# EAGLE schematic CFT-PB2-smd-revD (EAGLE 5.11)
DRAWN_BY: Alexios; PROJECT_NAME: CFT Mini-Computer; REVISION: Rev B; SHEET_DESCRIPTION: Cover Sheet; SIMULATION_FILENAME: register.v#reg_L; URL: http://www.bedroomlan.org/cft

## Sheet 1 of 6
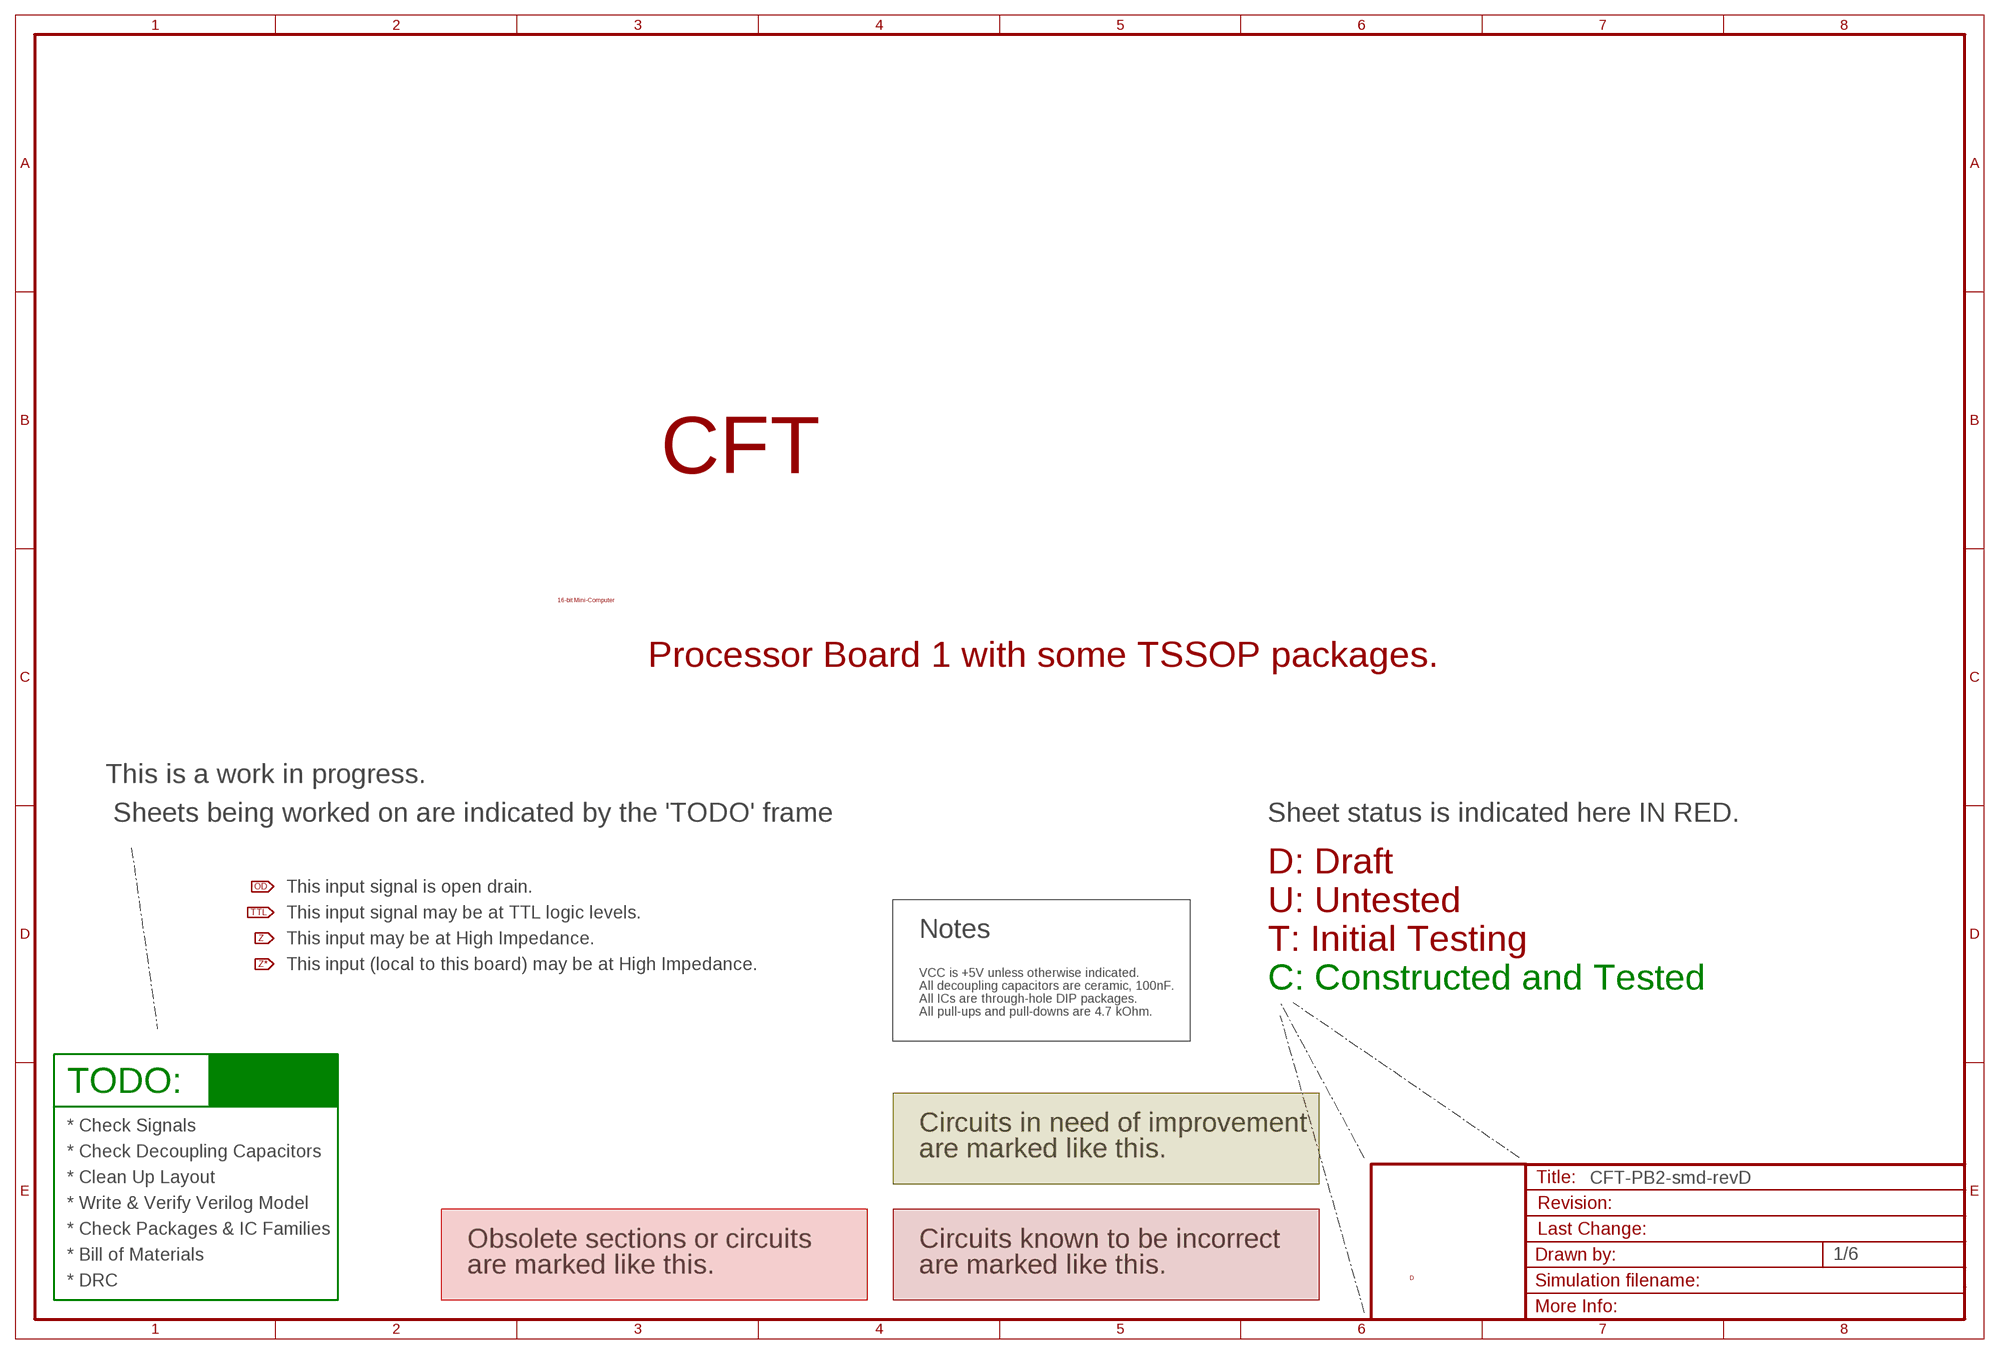
[diagram p0: schematic, sheet 1]

### Notes on the sheet
- CFT
- 16-bit Mini-Computer
- Processor Board 1 with some TSSOP packages.
- This is a work in progress.
- Sheets being worked on are indicated by the 'TODO' frame | Sheet status is indicated here IN RED.
- D: Draft
- This input signal is open drain.
- U: Untested
- This input signal may be at TTL logic levels.
- Notes
- This input may be at High Impedance.
- T: Initial Testing
- This input (local to this board) may be at High Impedance.
- VCC is +5V unless otherwise indicated.
- All decoupling capacitors are ceramic, 100nF. | C: Constructed and Tested
- All ICs are through-hole DIP packages.
- All pull-ups and pull-downs are 4.7 kOhm.
- TODO:
- * Check Signals | Circuits in need of improvement
- * Check Decoupling Capacitors | are marked like this.
- * Clean Up Layout
- * Write & Verify Verilog Model
- * Check Packages & IC Families
- Obsolete sections or circuits | Circuits known to be incorrect
- * Bill of Materials
- are marked like this. | are marked like this.
- D
- * DRC

## Sheet 2 of 6
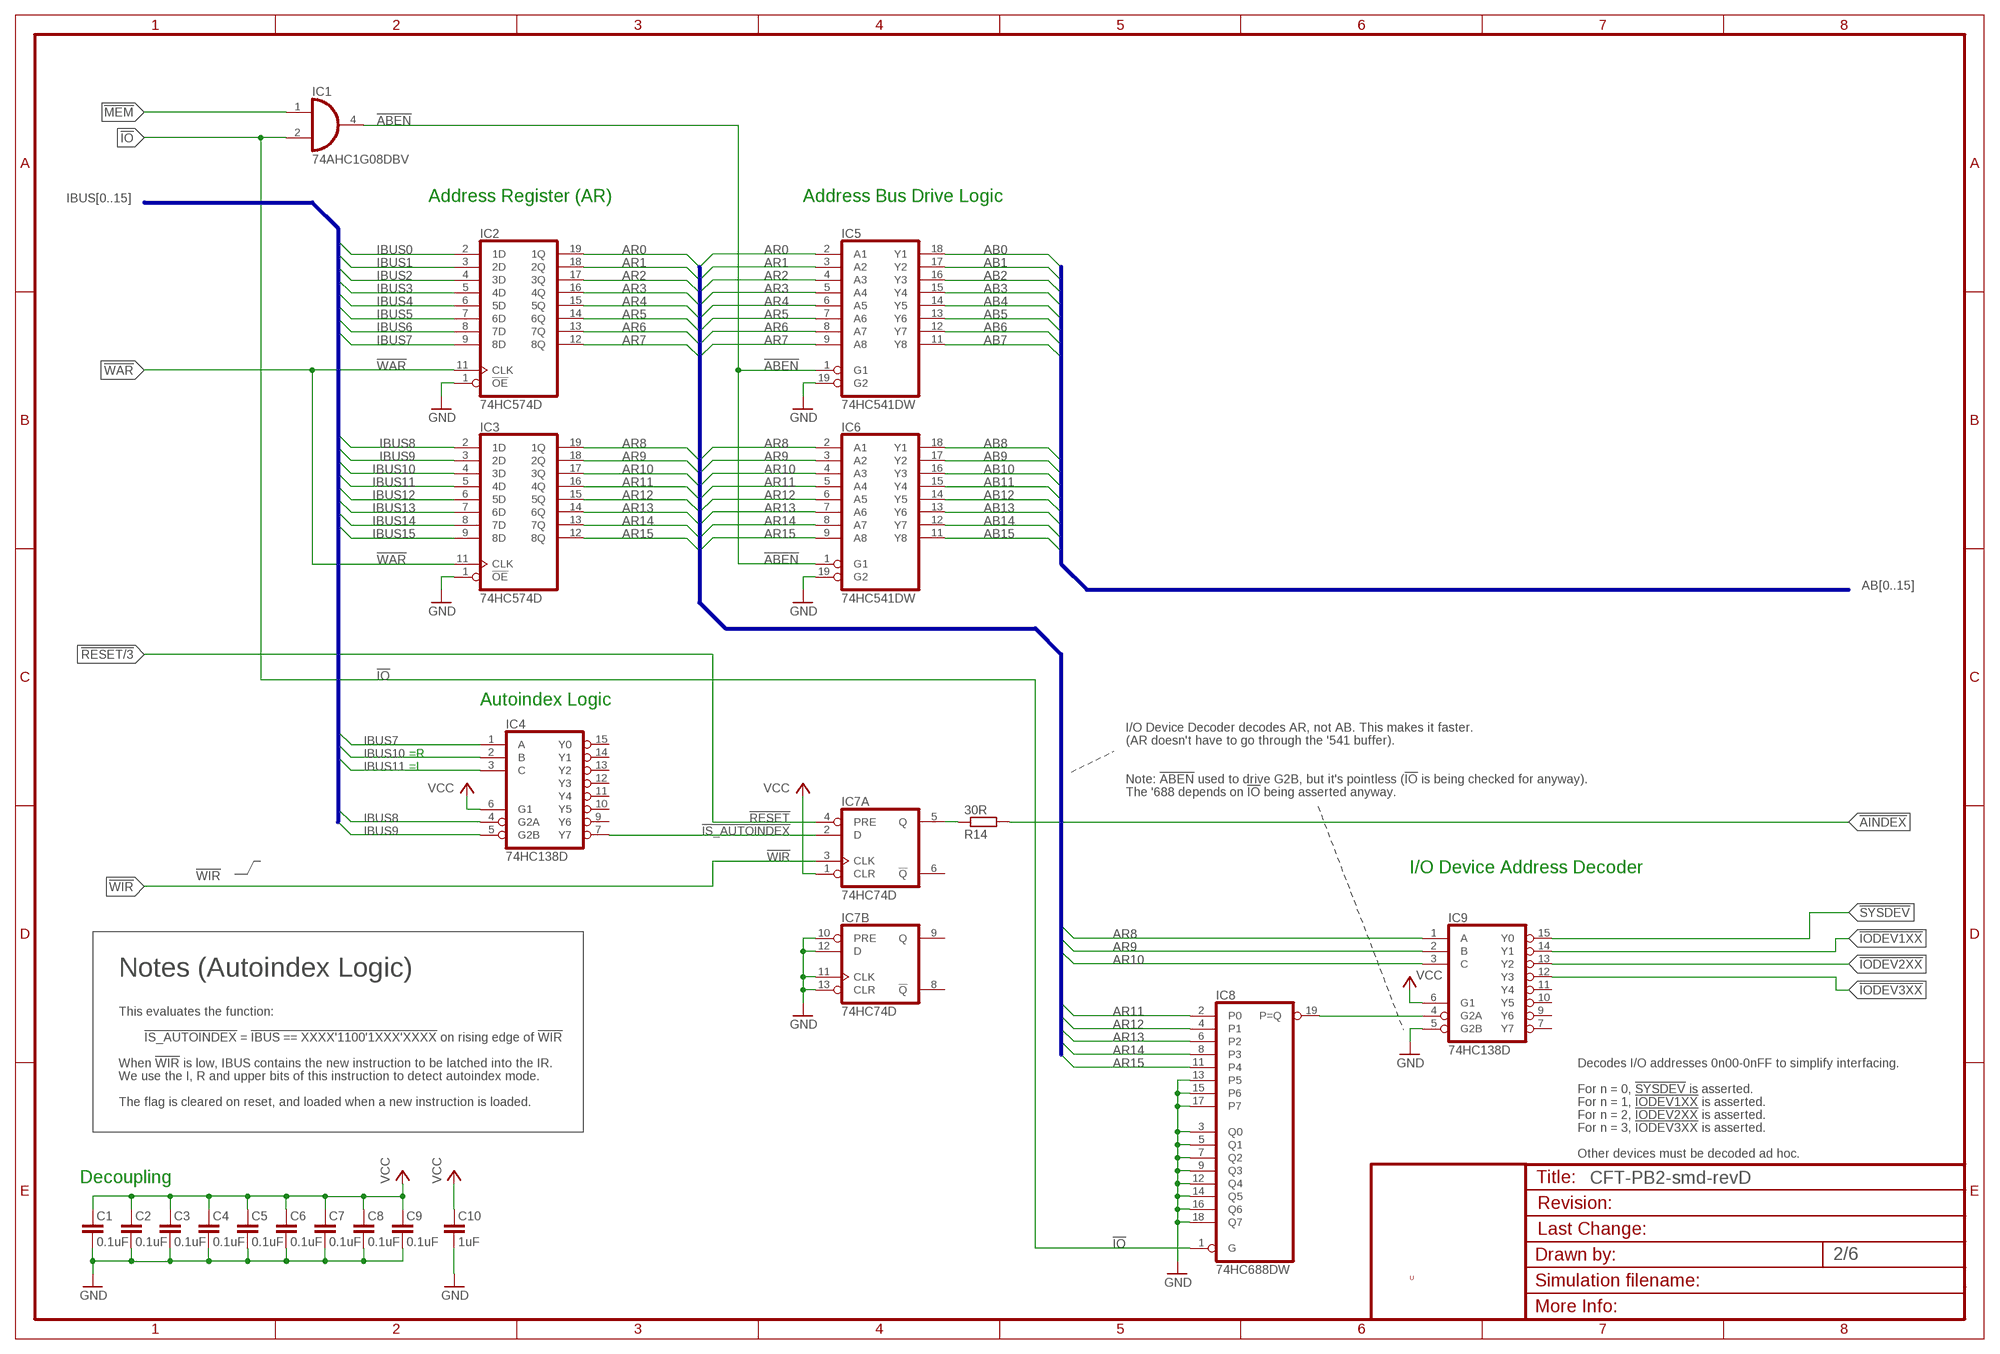
[diagram p1: schematic, sheet 2]

### Parts
C1  0.1uF  C-EUC0805K  [C0805K]
C2  0.1uF  C-EUC0805K  [C0805K]
C3  0.1uF  C-EUC0805K  [C0805K]
C4  0.1uF  C-EUC0805K  [C0805K]
C5  0.1uF  C-EUC0805K  [C0805K]
C6  0.1uF  C-EUC0805K  [C0805K]
C7  0.1uF  C-EUC0805K  [C0805K]
C8  0.1uF  C-EUC0805K  [C0805K]
C9  0.1uF  C-EUC0805K  [C0805K]
C10  1uF  C-EUC0805K  [C0805K]
IC1  74AHC1G08DBV  [SOT23-5]
IC2  74HC574D  [SO20W]
IC3  74HC574D  [SO20W]
IC4  74HC138D  [SO16]
IC5  74HC541DW  [SO20W]
IC6  74HC541DW  [SO20W]
IC7  74HC74D  [SO14]
IC8  74HC688DW  [SO20W]
IC9  74HC138D  [SO16]
R14  30R  R-EU_R0805  [R0805]

### Nets
!ABEN: IC1.4(O) IC5.1(G1) IC6.1(G1)
!AINDEX: R14.2 ; also sheet 6
!IO: IC1.2(I1) IC8.1(G) ; also sheet 6
!IODEV1XX: IC9.14(Y1) ; also sheet 6
!IODEV2XX: IC9.13(Y2) ; also sheet 6
!IODEV3XX: IC9.12(Y3) ; also sheet 6
!IS_AUTOINDEX: IC4.7(Y7) IC7.2(A:D)
!MEM: IC1.1(I0) ; also sheet 6
!RESET: IC7.4(A:PRE) ; also sheet 3,6
!SYSDEV: IC9.15(Y0) ; also sheet 6
!WAR: IC2.11(CLK) IC3.11(CLK) ; also sheet 6
!WIR: IC7.3(A:CLK) ; also sheet 6
AB0: IC5.18(Y1) ; also sheet 6
AB1: IC5.17(Y2) ; also sheet 6
AB2: IC5.16(Y3) ; also sheet 6
AB3: IC5.15(Y4) ; also sheet 6
AB4: IC5.14(Y5) ; also sheet 6
AB5: IC5.13(Y6) ; also sheet 6
AB6: IC5.12(Y7) ; also sheet 6
AB7: IC5.11(Y8) ; also sheet 6
AB8: IC6.18(Y1) ; also sheet 6
AB9: IC6.17(Y2) ; also sheet 6
AB10: IC6.16(Y3) ; also sheet 6
AB11: IC6.15(Y4) ; also sheet 6
AB12: IC6.14(Y5) ; also sheet 6
AB13: IC6.13(Y6) ; also sheet 6
AB14: IC6.12(Y7) ; also sheet 6
AB15: IC6.11(Y8) ; also sheet 6
AR0: IC2.19(1Q) IC5.2(A1)
AR1: IC2.18(2Q) IC5.3(A2)
AR2: IC2.17(3Q) IC5.4(A3)
AR3: IC2.16(4Q) IC5.5(A4)
AR4: IC2.15(5Q) IC5.6(A5)
AR5: IC2.14(6Q) IC5.7(A6)
AR6: IC2.13(7Q) IC5.8(A7)
AR7: IC2.12(8Q) IC5.9(A8)
AR8: IC3.19(1Q) IC6.2(A1) IC9.1(A)
AR9: IC3.18(2Q) IC6.3(A2) IC9.2(B)
AR10: IC3.17(3Q) IC6.4(A3) IC9.3(C)
AR11: IC3.16(4Q) IC6.5(A4) IC8.2(P0)
AR12: IC3.15(5Q) IC6.6(A5) IC8.4(P1)
AR13: IC3.14(6Q) IC6.7(A6) IC8.6(P2)
AR14: IC3.13(7Q) IC6.8(A7) IC8.8(P3)
AR15: IC3.12(8Q) IC6.9(A8) IC8.11(P4)
GND [low power]: C1.1 C2.1 C3.1 C4.1 C5.1 C6.1 C7.1 C8.1 C9.1 C10.1 IC2.1(!OE) IC3.1(!OE) IC5.19(G2) IC6.19(G2) IC7.10(B:PRE) IC7.11(B:CLK) IC7.12(B:D) IC7.13(B:CLR) IC8.3(Q0) IC8.5(Q1) IC8.7(Q2) IC8.9(Q3) IC8.12(Q4) IC8.13(P5) IC8.14(Q5) IC8.15(P6) IC8.16(Q6) IC8.17(P7) IC8.18(Q7) IC9.5(G2B) ; also sheet 3,4,5,6
IBUS0: IC2.2(1D) ; also sheet 3,4,5,6
IBUS1: IC2.3(2D) ; also sheet 3,4,5,6
IBUS2: IC2.4(3D) ; also sheet 3,4,5,6
IBUS3: IC2.5(4D) ; also sheet 3,4,5,6
IBUS4: IC2.6(5D) ; also sheet 3,4,5,6
IBUS5: IC2.7(6D) ; also sheet 3,4,5,6
IBUS6: IC2.8(7D) ; also sheet 3,4,5,6
IBUS7: IC2.9(8D) IC4.1(A) ; also sheet 3,4,5,6
IBUS8: IC3.2(1D) IC4.4(G2A) ; also sheet 3,4,5,6
IBUS9: IC3.3(2D) IC4.5(G2B) ; also sheet 3,4,5,6
IBUS10: IC3.4(3D) IC4.2(B) ; also sheet 3,4,5,6
IBUS11: IC3.5(4D) IC4.3(C) ; also sheet 3,4,5,6
IBUS12: IC3.6(5D) ; also sheet 3,4,5,6
IBUS13: IC3.7(6D) ; also sheet 3,4,5,6
IBUS14: IC3.8(7D) ; also sheet 3,4,5,6
IBUS15: IC3.9(8D) ; also sheet 3,4,5,6
N$51: IC7.5(A:Q) R14.1
N$95: IC8.19(P=Q) IC9.4(G2A)
VCC [low power]: C1.2 C2.2 C3.2 C4.2 C5.2 C6.2 C7.2 C8.2 C9.2 C10.2 IC4.6(G1) IC7.1(A:CLR) IC9.6(G1) ; also sheet 3,4,5,6
Unconnected: IC4.9(Y6) IC4.10(Y5) IC4.11(Y4) IC4.12(Y3) IC4.13(Y2) IC4.14(Y1) IC4.15(Y0) IC7.6(A:!Q) IC7.8(B:!Q) IC7.9(B:Q) IC9.7(Y7) IC9.9(Y6) IC9.10(Y5) IC9.11(Y4)

### Buses
AR[0..15]
IBUS[0..15]
AB[0..15]

### Notes on the sheet
- Address Register (AR) | Address Bus Drive Logic
- Autoindex Logic
- I/O Device Decoder decodes AR, not AB. This makes it faster.
- (AR doesn't have to go through the '541 buffer).
- =R
- =I
- Note: !ABEN! used to drive G2B, but it's pointless (!IO! is being checked for anyway).
- The '688 depends on !IO! being asserted anyway.
- I/O Device Address Decoder
- Notes (Autoindex Logic)
- This evaluates the function:
- !IS_AUTOINDEX! = !IBUS == XXXX'1100'1XXX'XXXX! on rising edge of !WIR!
- When !WIR! is low, IBUS contains the new instruction to be latched into the IR. | Decodes I/O addresses 0n00-0nFF to simplify interfacing.
- We use the I, R and upper bits of this instruction to detect autoindex mode.
- For n = 0, !SYSDEV! is asserted.
- The flag is cleared on reset, and loaded when a new instruction is loaded. | For n = 1, !IODEV1XX! is asserted.
- For n = 2, !IODEV2XX! is asserted.
- For n = 3, !IODEV3XX! is asserted.
- Other devices must be decoded ad hoc.
- Decoupling
- U

## Sheet 3 of 6
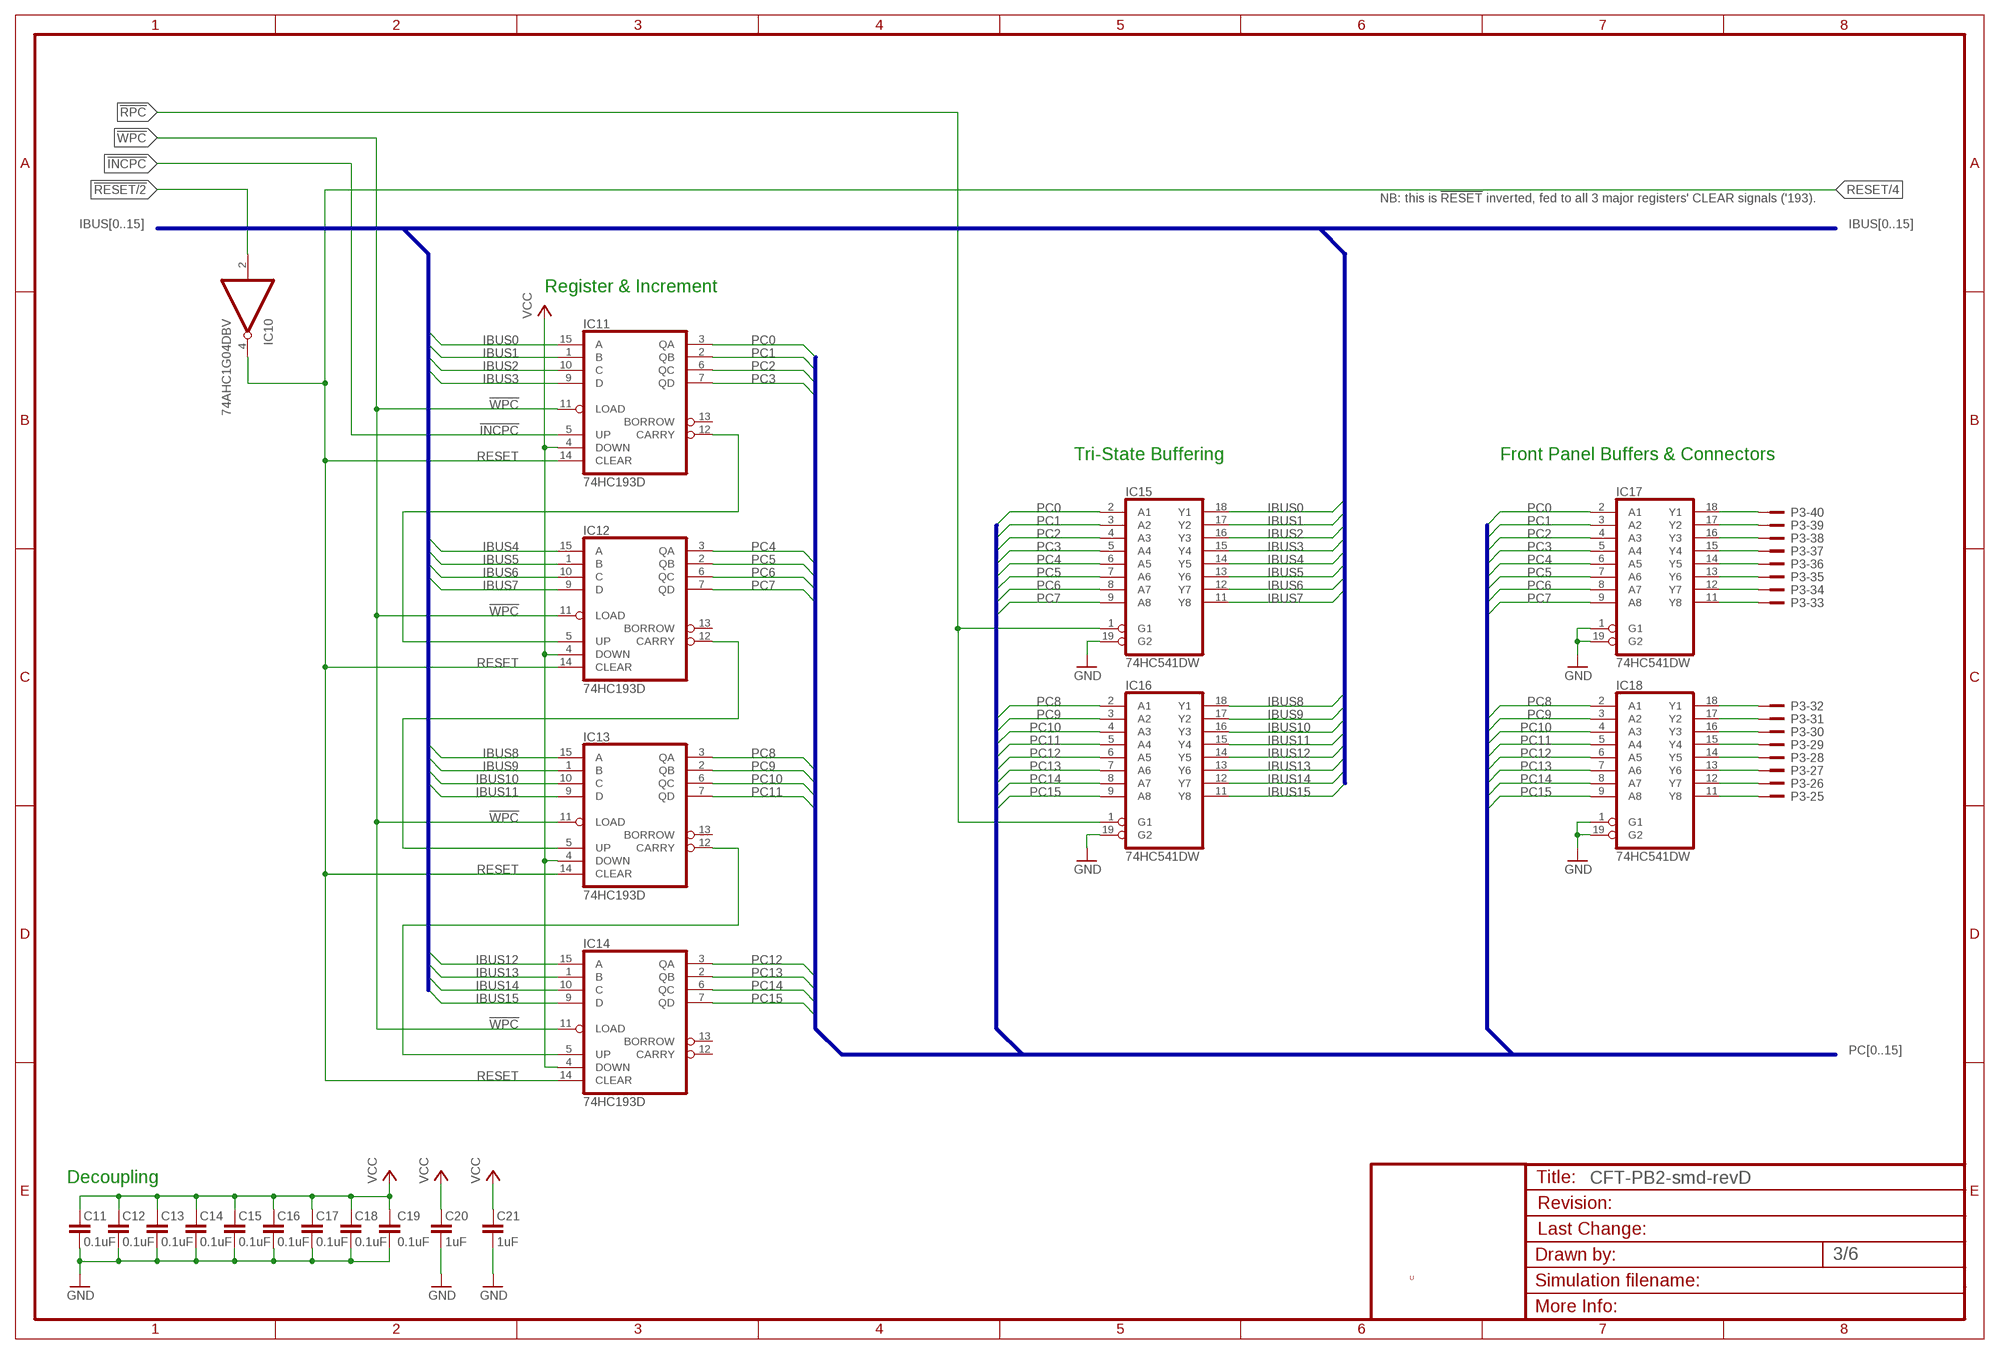
[diagram p2: schematic, sheet 3]

### Parts
C11  0.1uF  C-EUC0805K  [C0805K]
C12  0.1uF  C-EUC0805K  [C0805K]
C13  0.1uF  C-EUC0805K  [C0805K]
C14  0.1uF  C-EUC0805K  [C0805K]
C15  0.1uF  C-EUC0805K  [C0805K]
C16  0.1uF  C-EUC0805K  [C0805K]
C17  0.1uF  C-EUC0805K  [C0805K]
C18  0.1uF  C-EUC0805K  [C0805K]
C19  0.1uF  C-EUC0805K  [C0805K]
C20  1uF  C-EUC0805K  [C0805K]
C21  1uF  C-EUC0805K  [C0805K]
IC10  74AHC1G04DBV  [SOT23-5]
IC11  74HC193D  [SO16D]
IC12  74HC193D  [SO16D]
IC13  74HC193D  [SO16D]
IC14  74HC193D  [SO16D]
IC15  74HC541DW  [SO20W]
IC16  74HC541DW  [SO20W]
IC17  74HC541DW  [SO20W]
IC18  74HC541DW  [SO20W]
P3  2540-5  [PAK100/2500-5-40]

### Nets
!INCPC: IC11.5(UP) ; also sheet 6
!RESET: IC10.2(I) ; also sheet 2,6
!RPC: IC15.1(G1) IC16.1(G1) ; also sheet 6
!WPC: IC11.11(LOAD) IC12.11(LOAD) IC13.11(LOAD) IC14.11(LOAD) ; also sheet 6
GND [low power]: C11.1 C12.1 C13.1 C14.1 C15.1 C16.1 C17.1 C18.1 C19.2 C20.1 C21.1 IC15.19(G2) IC16.19(G2) IC17.1(G1) IC17.19(G2) IC18.1(G1) IC18.19(G2) ; also sheet 2,4,5,6
IBUS0: IC11.15(A) IC15.18(Y1) ; also sheet 2,4,5,6
IBUS1: IC11.1(B) IC15.17(Y2) ; also sheet 2,4,5,6
IBUS2: IC11.10(C) IC15.16(Y3) ; also sheet 2,4,5,6
IBUS3: IC11.9(D) IC15.15(Y4) ; also sheet 2,4,5,6
IBUS4: IC12.15(A) IC15.14(Y5) ; also sheet 2,4,5,6
IBUS5: IC12.1(B) IC15.13(Y6) ; also sheet 2,4,5,6
IBUS6: IC12.10(C) IC15.12(Y7) ; also sheet 2,4,5,6
IBUS7: IC12.9(D) IC15.11(Y8) ; also sheet 2,4,5,6
IBUS8: IC13.15(A) IC16.18(Y1) ; also sheet 2,4,5,6
IBUS9: IC13.1(B) IC16.17(Y2) ; also sheet 2,4,5,6
IBUS10: IC13.10(C) IC16.16(Y3) ; also sheet 2,4,5,6
IBUS11: IC13.9(D) IC16.15(Y4) ; also sheet 2,4,5,6
IBUS12: IC14.15(A) IC16.14(Y5) ; also sheet 2,4,5,6
IBUS13: IC14.1(B) IC16.13(Y6) ; also sheet 2,4,5,6
IBUS14: IC14.10(C) IC16.12(Y7) ; also sheet 2,4,5,6
IBUS15: IC14.9(D) IC16.11(Y8) ; also sheet 2,4,5,6
N$1: IC17.18(Y1) P3.40
N$2: IC17.15(Y4) P3.37
N$3: IC17.16(Y3) P3.38
N$4: IC17.17(Y2) P3.39
N$5: IC17.14(Y5) P3.36
N$6: IC17.13(Y6) P3.35
N$7: IC17.12(Y7) P3.34
N$8: IC17.11(Y8) P3.33
N$9: IC18.17(Y2) P3.31
N$10: IC18.18(Y1) P3.32
N$11: IC18.16(Y3) P3.30
N$12: IC18.15(Y4) P3.29
N$13: IC18.14(Y5) P3.28
N$14: IC18.13(Y6) P3.27
N$15: IC18.12(Y7) P3.26
N$16: IC18.11(Y8) P3.25
N$70: IC11.12(CARRY) IC12.5(UP)
N$71: IC12.12(CARRY) IC13.5(UP)
N$734: IC13.12(CARRY) IC14.5(UP)
PC0: IC11.3(QA) IC15.2(A1) IC17.2(A1)
PC1: IC11.2(QB) IC15.3(A2) IC17.3(A2)
PC2: IC11.6(QC) IC15.4(A3) IC17.4(A3)
PC3: IC11.7(QD) IC15.5(A4) IC17.5(A4)
PC4: IC12.3(QA) IC15.6(A5) IC17.6(A5)
PC5: IC12.2(QB) IC15.7(A6) IC17.7(A6)
PC6: IC12.6(QC) IC15.8(A7) IC17.8(A7)
PC7: IC12.7(QD) IC15.9(A8) IC17.9(A8)
PC8: IC13.3(QA) IC16.2(A1) IC18.2(A1)
PC9: IC13.2(QB) IC16.3(A2) IC18.3(A2)
PC10: IC13.6(QC) IC16.4(A3) IC18.4(A3) ; also sheet 6
PC11: IC13.7(QD) IC16.5(A4) IC18.5(A4) ; also sheet 6
PC12: IC14.3(QA) IC16.6(A5) IC18.6(A5) ; also sheet 6
PC13: IC14.2(QB) IC16.7(A6) IC18.7(A6) ; also sheet 6
PC14: IC14.6(QC) IC16.8(A7) IC18.8(A7) ; also sheet 6
PC15: IC14.7(QD) IC16.9(A8) IC18.9(A8) ; also sheet 6
RESET: IC10.4(O) IC11.14(CLEAR) IC12.14(CLEAR) IC13.14(CLEAR) IC14.14(CLEAR) ; also sheet 4,5
VCC [low power]: C11.2 C12.2 C13.2 C14.2 C15.2 C16.2 C17.2 C18.2 C19.1 C20.2 C21.2 IC11.4(DOWN) IC12.4(DOWN) IC13.4(DOWN) IC14.4(DOWN) ; also sheet 2,4,5,6
Unconnected: IC11.13(BORROW) IC12.13(BORROW) IC13.13(BORROW) IC14.12(CARRY) IC14.13(BORROW)

### Buses
IBUS[0..15]
PC[0..15]

### Notes on the sheet
- NB: this is !RESET! inverted, fed to all 3 major registers' CLEAR signals ('193).
- Register & Increment
- Tri-State Buffering | Front Panel Buffers & Connectors
- Decoupling
- U

## Sheet 4 of 6
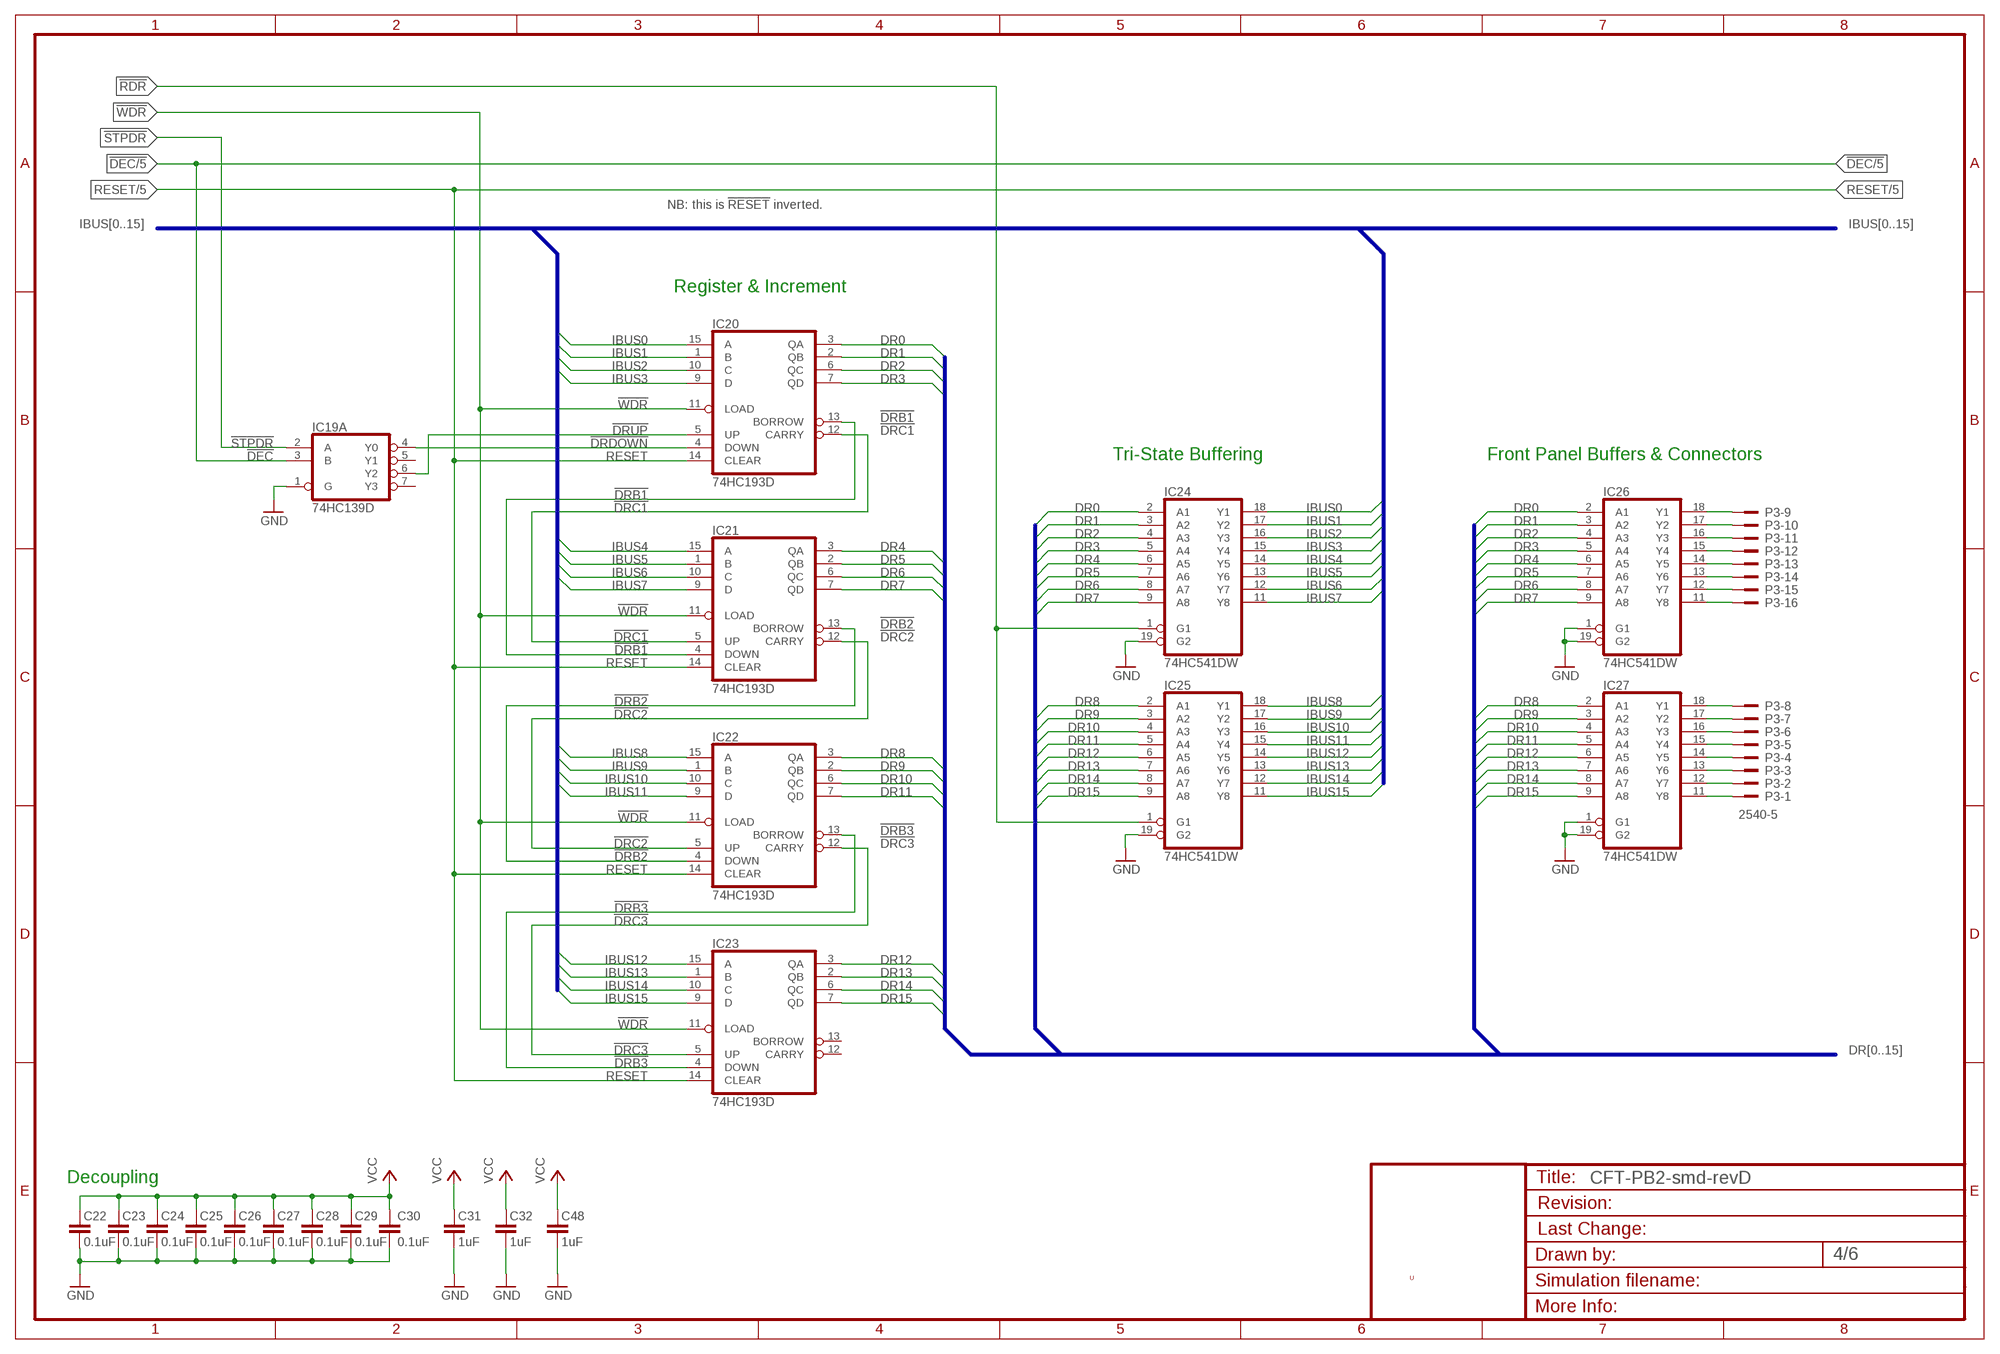
[diagram p3: schematic, sheet 4]

### Parts
C22  0.1uF  C-EUC0805K  [C0805K]
C23  0.1uF  C-EUC0805K  [C0805K]
C24  0.1uF  C-EUC0805K  [C0805K]
C25  0.1uF  C-EUC0805K  [C0805K]
C26  0.1uF  C-EUC0805K  [C0805K]
C27  0.1uF  C-EUC0805K  [C0805K]
C28  0.1uF  C-EUC0805K  [C0805K]
C29  0.1uF  C-EUC0805K  [C0805K]
C30  0.1uF  C-EUC0805K  [C0805K]
C31  1uF  C-EUC0805K  [C0805K]
C32  1uF  C-EUC0805K  [C0805K]
C48  1uF  C-EUC0805K  [C0805K]
IC19  74HC139D  [SO16]
IC20  74HC193D  [SO16D]
IC21  74HC193D  [SO16D]
IC22  74HC193D  [SO16D]
IC23  74HC193D  [SO16D]
IC24  74HC541DW  [SO20W]
IC25  74HC541DW  [SO20W]
IC26  74HC541DW  [SO20W]
IC27  74HC541DW  [SO20W]

### Nets
!DEC: IC19.3(A:B) ; also sheet 5,6
!DRB1: IC20.13(BORROW) IC21.4(DOWN)
!DRB2: IC21.13(BORROW) IC22.4(DOWN)
!DRB3: IC22.13(BORROW) IC23.4(DOWN)
!DRC1: IC20.12(CARRY) IC21.5(UP)
!DRC2: IC21.12(CARRY) IC22.5(UP)
!DRC3: IC22.12(CARRY) IC23.5(UP)
!DRDOWN: IC19.4(A:Y0) IC20.4(DOWN)
!DRUP: IC19.6(A:Y2) IC20.5(UP)
!RDR: IC24.1(G1) IC25.1(G1) ; also sheet 6
!STPDR: IC19.2(A:A) ; also sheet 6
!WDR: IC20.11(LOAD) IC21.11(LOAD) IC22.11(LOAD) IC23.11(LOAD) ; also sheet 6
DR0: IC20.3(QA) IC24.2(A1) IC26.2(A1)
DR1: IC20.2(QB) IC24.3(A2) IC26.3(A2)
DR2: IC20.6(QC) IC24.4(A3) IC26.4(A3)
DR3: IC20.7(QD) IC24.5(A4) IC26.5(A4)
DR4: IC21.3(QA) IC24.6(A5) IC26.6(A5)
DR5: IC21.2(QB) IC24.7(A6) IC26.7(A6)
DR6: IC21.6(QC) IC24.8(A7) IC26.8(A7)
DR7: IC21.7(QD) IC24.9(A8) IC26.9(A8)
DR8: IC22.3(QA) IC25.2(A1) IC27.2(A1)
DR9: IC22.2(QB) IC25.3(A2) IC27.3(A2)
DR10: IC22.6(QC) IC25.4(A3) IC27.4(A3)
DR11: IC22.7(QD) IC25.5(A4) IC27.5(A4)
DR12: IC23.3(QA) IC25.6(A5) IC27.6(A5)
DR13: IC23.2(QB) IC25.7(A6) IC27.7(A6)
DR14: IC23.6(QC) IC25.8(A7) IC27.8(A7)
DR15: IC23.7(QD) IC25.9(A8) IC27.9(A8)
GND [low power]: C22.1 C23.1 C24.1 C25.1 C26.1 C27.1 C28.1 C29.1 C30.2 C31.1 C32.1 C48.1 IC19.1(A:G) IC24.19(G2) IC25.19(G2) IC26.1(G1) IC26.19(G2) IC27.1(G1) IC27.19(G2) ; also sheet 2,3,5,6
IBUS0: IC20.15(A) IC24.18(Y1) ; also sheet 2,3,5,6
IBUS1: IC20.1(B) IC24.17(Y2) ; also sheet 2,3,5,6
IBUS2: IC20.10(C) IC24.16(Y3) ; also sheet 2,3,5,6
IBUS3: IC20.9(D) IC24.15(Y4) ; also sheet 2,3,5,6
IBUS4: IC21.15(A) IC24.14(Y5) ; also sheet 2,3,5,6
IBUS5: IC21.1(B) IC24.13(Y6) ; also sheet 2,3,5,6
IBUS6: IC21.10(C) IC24.12(Y7) ; also sheet 2,3,5,6
IBUS7: IC21.9(D) IC24.11(Y8) ; also sheet 2,3,5,6
IBUS8: IC22.15(A) IC25.18(Y1) ; also sheet 2,3,5,6
IBUS9: IC22.1(B) IC25.17(Y2) ; also sheet 2,3,5,6
IBUS10: IC22.10(C) IC25.16(Y3) ; also sheet 2,3,5,6
IBUS11: IC22.9(D) IC25.15(Y4) ; also sheet 2,3,5,6
IBUS12: IC23.15(A) IC25.14(Y5) ; also sheet 2,3,5,6
IBUS13: IC23.1(B) IC25.13(Y6) ; also sheet 2,3,5,6
IBUS14: IC23.10(C) IC25.12(Y7) ; also sheet 2,3,5,6
IBUS15: IC23.9(D) IC25.11(Y8) ; also sheet 2,3,5,6
N$17: IC27.11(Y8) P3.1
N$18: IC27.12(Y7) P3.2
N$19: IC27.13(Y6) P3.3
N$20: IC27.14(Y5) P3.4
N$21: IC27.15(Y4) P3.5
N$22: IC27.16(Y3) P3.6
N$23: IC27.17(Y2) P3.7
N$24: IC27.18(Y1) P3.8
N$25: IC26.18(Y1) P3.9
N$26: IC26.17(Y2) P3.10
N$27: IC26.16(Y3) P3.11
N$28: IC26.15(Y4) P3.12
N$29: IC26.14(Y5) P3.13
N$30: IC26.13(Y6) P3.14
N$31: IC26.12(Y7) P3.15
N$32: IC26.11(Y8) P3.16
RESET: IC20.14(CLEAR) IC21.14(CLEAR) IC22.14(CLEAR) IC23.14(CLEAR) ; also sheet 3,5
VCC [low power]: C22.2 C23.2 C24.2 C25.2 C26.2 C27.2 C28.2 C29.2 C30.1 C31.2 C32.2 C48.2 ; also sheet 2,3,5,6
Unconnected: IC19.5(A:Y1) IC19.7(A:Y3) IC23.12(CARRY) IC23.13(BORROW)

### Buses
IBUS[0..15]
DR[0..15]

### Notes on the sheet
- NB: this is !RESET! inverted.
- Register & Increment
- Tri-State Buffering | Front Panel Buffers & Connectors
- Decoupling
- U

## Sheet 5 of 6
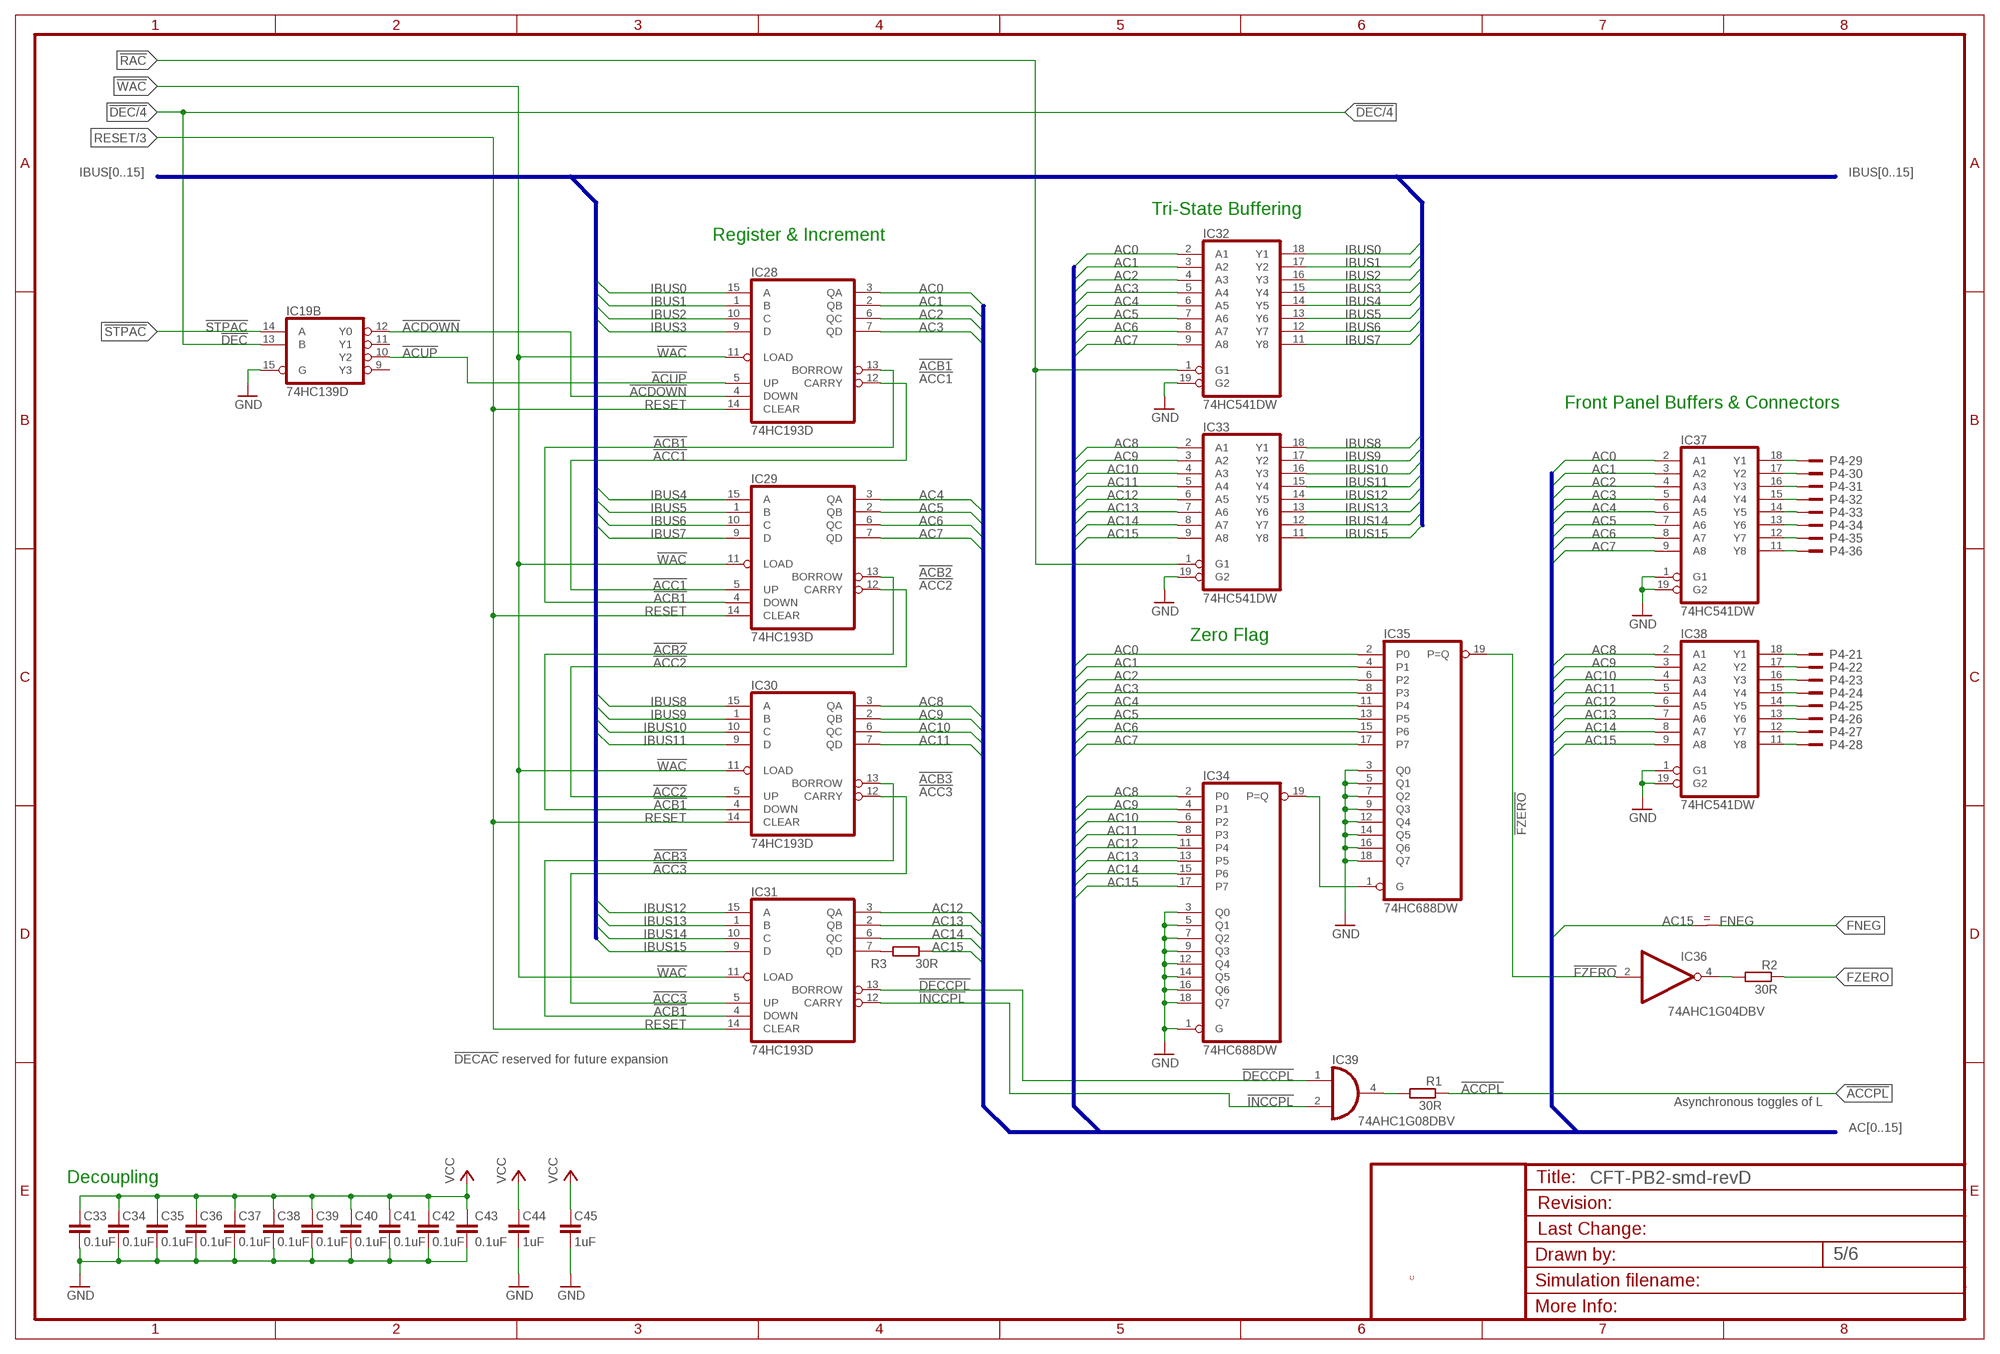
[diagram p4: schematic, sheet 5]

### Parts
C33  0.1uF  C-EUC0805K  [C0805K]
C34  0.1uF  C-EUC0805K  [C0805K]
C35  0.1uF  C-EUC0805K  [C0805K]
C36  0.1uF  C-EUC0805K  [C0805K]
C37  0.1uF  C-EUC0805K  [C0805K]
C38  0.1uF  C-EUC0805K  [C0805K]
C39  0.1uF  C-EUC0805K  [C0805K]
C40  0.1uF  C-EUC0805K  [C0805K]
C41  0.1uF  C-EUC0805K  [C0805K]
C42  0.1uF  C-EUC0805K  [C0805K]
C43  0.1uF  C-EUC0805K  [C0805K]
C44  1uF  C-EUC0805K  [C0805K]
C45  1uF  C-EUC0805K  [C0805K]
IC28  74HC193D  [SO16D]
IC29  74HC193D  [SO16D]
IC30  74HC193D  [SO16D]
IC31  74HC193D  [SO16D]
IC32  74HC541DW  [SO20W]
IC33  74HC541DW  [SO20W]
IC34  74HC688DW  [SO20W]
IC35  74HC688DW  [SO20W]
IC36  74AHC1G04DBV  [SOT23-5]
IC37  74HC541DW  [SO20W]
IC38  74HC541DW  [SO20W]
IC39  74AHC1G08DBV  [SOT23-5]
P4  2540-5  [PAK100/2500-5-40]
R1  30R  R-EU_R0805  [R0805]
R2  30R  R-EU_R0805  [R0805]
R3  30R  R-EU_R0805  [R0805]
X1  SIGNAL-RENAME  [SIGNAL-RENAME]

### Nets
!ACB1: IC28.13(BORROW) IC29.4(DOWN)
!ACB2: IC29.13(BORROW) IC30.4(DOWN)
!ACB3: IC30.13(BORROW) IC31.4(DOWN)
!ACC1: IC28.12(CARRY) IC29.5(UP)
!ACC2: IC29.12(CARRY) IC30.5(UP)
!ACC3: IC30.12(CARRY) IC31.5(UP)
!ACCPL: R1.1 ; also sheet 6
!ACDOWN: IC19.12(B:Y0) IC28.4(DOWN)
!ACUP: IC19.10(B:Y2) IC28.5(UP)
!DEC: IC19.13(B:B) ; also sheet 4,6
!DECCPL: IC31.13(BORROW) IC39.1(I0)
!FZERO: IC35.19(P=Q) IC36.2(I)
!INCCPL: IC31.12(CARRY) IC39.2(I1)
!RAC: IC32.1(G1) IC33.1(G1) ; also sheet 6
!STPAC: IC19.14(B:A) ; also sheet 6
!WAC: IC28.11(LOAD) IC29.11(LOAD) IC30.11(LOAD) IC31.11(LOAD) ; also sheet 6
AC0: IC28.3(QA) IC32.2(A1) IC35.2(P0) IC37.2(A1) ; also sheet 6
AC1: IC28.2(QB) IC32.3(A2) IC35.4(P1) IC37.3(A2) ; also sheet 6
AC2: IC28.6(QC) IC32.4(A3) IC35.6(P2) IC37.4(A3) ; also sheet 6
AC3: IC28.7(QD) IC32.5(A4) IC35.8(P3) IC37.5(A4) ; also sheet 6
AC4: IC29.3(QA) IC32.6(A5) IC35.11(P4) IC37.6(A5) ; also sheet 6
AC5: IC29.2(QB) IC32.7(A6) IC35.13(P5) IC37.7(A6) ; also sheet 6
AC6: IC29.6(QC) IC32.8(A7) IC35.15(P6) IC37.8(A7) ; also sheet 6
AC7: IC29.7(QD) IC32.9(A8) IC35.17(P7) IC37.9(A8) ; also sheet 6
AC8: IC30.3(QA) IC33.2(A1) IC34.2(P0) IC38.2(A1) ; also sheet 6
AC9: IC30.2(QB) IC33.3(A2) IC34.4(P1) IC38.3(A2) ; also sheet 6
AC10: IC30.6(QC) IC33.4(A3) IC34.6(P2) IC38.4(A3) ; also sheet 6
AC11: IC30.7(QD) IC33.5(A4) IC34.8(P3) IC38.5(A4) ; also sheet 6
AC12: IC31.3(QA) IC33.6(A5) IC34.11(P4) IC38.6(A5) ; also sheet 6
AC13: IC31.2(QB) IC33.7(A6) IC34.13(P5) IC38.7(A6) ; also sheet 6
AC14: IC31.6(QC) IC33.8(A7) IC34.15(P6) IC38.8(A7) ; also sheet 6
AC15: IC33.9(A8) IC34.17(P7) IC38.9(A8) R3.1 X1.P$1 ; also sheet 6
FNEG: X1.P$2 ; also sheet 6
FZERO: R2.1 ; also sheet 6
GND [low power]: C33.1 C34.1 C35.1 C36.1 C37.1 C38.1 C39.1 C40.1 C41.1 C42.1 C43.2 C44.1 C45.1 IC19.15(B:G) IC32.19(G2) IC33.19(G2) IC34.1(G) IC34.3(Q0) IC34.5(Q1) IC34.7(Q2) IC34.9(Q3) IC34.12(Q4) IC34.14(Q5) IC34.16(Q6) IC34.18(Q7) IC35.3(Q0) IC35.5(Q1) IC35.7(Q2) IC35.9(Q3) IC35.12(Q4) IC35.14(Q5) IC35.16(Q6) IC35.18(Q7) IC37.1(G1) IC37.19(G2) IC38.1(G1) IC38.19(G2) ; also sheet 2,3,4,6
IBUS0: IC28.15(A) IC32.18(Y1) ; also sheet 2,3,4,6
IBUS1: IC28.1(B) IC32.17(Y2) ; also sheet 2,3,4,6
IBUS2: IC28.10(C) IC32.16(Y3) ; also sheet 2,3,4,6
IBUS3: IC28.9(D) IC32.15(Y4) ; also sheet 2,3,4,6
IBUS4: IC29.15(A) IC32.14(Y5) ; also sheet 2,3,4,6
IBUS5: IC29.1(B) IC32.13(Y6) ; also sheet 2,3,4,6
IBUS6: IC29.10(C) IC32.12(Y7) ; also sheet 2,3,4,6
IBUS7: IC29.9(D) IC32.11(Y8) ; also sheet 2,3,4,6
IBUS8: IC30.15(A) IC33.18(Y1) ; also sheet 2,3,4,6
IBUS9: IC30.1(B) IC33.17(Y2) ; also sheet 2,3,4,6
IBUS10: IC30.10(C) IC33.16(Y3) ; also sheet 2,3,4,6
IBUS11: IC30.9(D) IC33.15(Y4) ; also sheet 2,3,4,6
IBUS12: IC31.15(A) IC33.14(Y5) ; also sheet 2,3,4,6
IBUS13: IC31.1(B) IC33.13(Y6) ; also sheet 2,3,4,6
IBUS14: IC31.10(C) IC33.12(Y7) ; also sheet 2,3,4,6
IBUS15: IC31.9(D) IC33.11(Y8) ; also sheet 2,3,4,6
N$33: IC38.11(Y8) P4.28
N$34: IC38.12(Y7) P4.27
N$35: IC38.13(Y6) P4.26
N$36: IC38.14(Y5) P4.25
N$37: IC38.17(Y2) P4.22
N$38: IC38.16(Y3) P4.23
N$39: IC38.15(Y4) P4.24
N$40: IC38.18(Y1) P4.21
N$41: IC37.18(Y1) P4.29
N$42: IC37.17(Y2) P4.30
N$43: IC37.16(Y3) P4.31
N$44: IC37.15(Y4) P4.32
N$45: IC37.14(Y5) P4.33
N$46: IC37.13(Y6) P4.34
N$47: IC37.12(Y7) P4.35
N$48: IC37.11(Y8) P4.36
N$49: IC39.4(O) R1.2
N$50: IC36.4(O) R2.2
N$52: IC31.7(QD) R3.2
N$793: IC34.19(P=Q) IC35.1(G)
RESET: IC28.14(CLEAR) IC29.14(CLEAR) IC30.14(CLEAR) IC31.14(CLEAR) ; also sheet 3,4
VCC [low power]: C33.2 C34.2 C35.2 C36.2 C37.2 C38.2 C39.2 C40.2 C41.2 C42.2 C43.1 C44.2 C45.2 ; also sheet 2,3,4,6
Unconnected: IC19.9(B:Y3) IC19.11(B:Y1)

### Buses
IBUS[0..15]
AC[0..15]

### Notes on the sheet
- Tri-State Buffering
- Register & Increment
- Front Panel Buffers & Connectors
- Zero Flag
- !DECAC! reserved for future expansion
- Asynchronous toggles of L
- Decoupling
- U

## Sheet 6 of 6
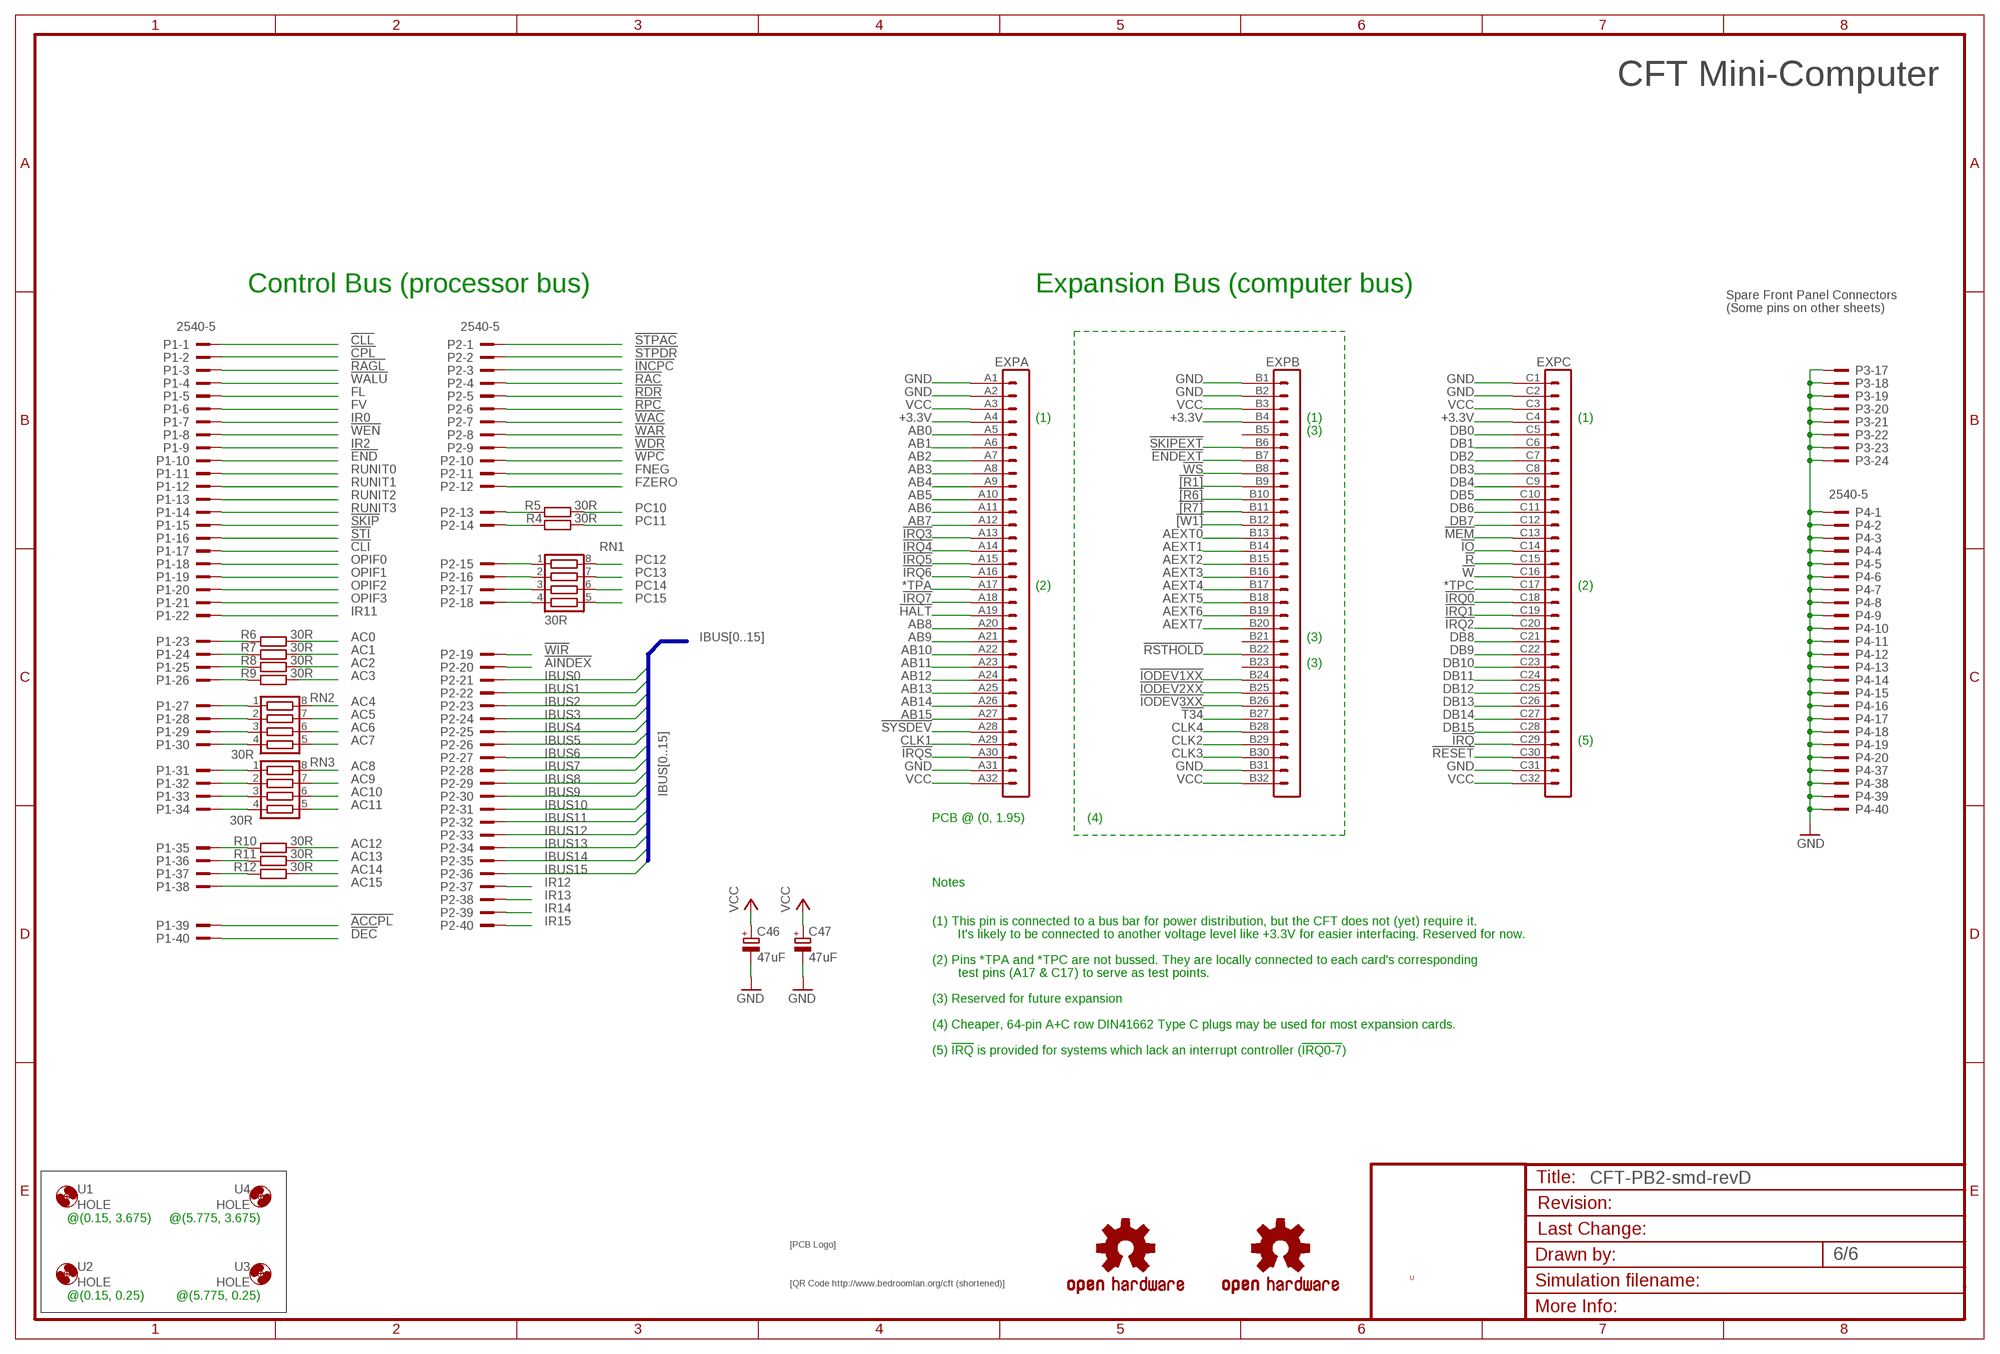
[diagram p5: schematic, sheet 6]

### Parts
$4_37_$  SIGNATURESILK  [SIGNATURE]
$4_39_$  OSHW-LOGOL  [OSHW-LOGO-L]
$4_39_$1  OSHW-LOGOL  [OSHW-LOGO-L]
$4_40_$  QRCODE-CFT  [CFT-QRCODE]
C46  47uF  CPOL-EUE2.5-5  [E2,5-5]
C47  47uF  CPOL-EUE2.5-5  [E2,5-5]
EXP  VG96-3K  [VG96K]
P1  2540-5  [PAK100/2500-5-40]
P2  2540-5  [PAK100/2500-5-40]
R4  30R  R-EU_R0805  [R0805]
R5  30R  R-EU_R0805  [R0805]
R6  30R  R-EU_R0805  [R0805]
R7  30R  R-EU_R0805  [R0805]
R8  30R  R-EU_R0805  [R0805]
R9  30R  R-EU_R0805  [R0805]
R10  30R  R-EU_R0805  [R0805]
R11  30R  R-EU_R0805  [R0805]
R12  30R  R-EU_R0805  [R0805]
RN1  30R  CTS742C083  [CTS742C083]
RN2  30R  CTS742C083  [CTS742C083]
RN3  30R  CTS742C083  [CTS742C083]
U1  HOLE  [STANDOFF_28_60]
U2  HOLE  [STANDOFF_28_60]
U3  HOLE  [STANDOFF_28_60]
U4  HOLE  [STANDOFF_28_60]

### Nets
![R1]: EXP.B9
![R6]: EXP.B10
![R7]: EXP.B11
![W1]: EXP.B12
!ACCPL: P1.39 ; also sheet 5
!AINDEX: P2.20 ; also sheet 2
!CLI: P1.17
!CLL: P1.1
!CPL: P1.2
!DEC: P1.40 ; also sheet 4,5
!END: P1.10
!ENDEXT: EXP.B7
!HALT: EXP.A19
!INCPC: P2.3 ; also sheet 3
!IO: EXP.C14 ; also sheet 2
!IODEV1XX: EXP.B24 ; also sheet 2
!IODEV2XX: EXP.B25 ; also sheet 2
!IODEV3XX: EXP.B26 ; also sheet 2
!IRQ: EXP.C29
!IRQ0: EXP.C18
!IRQ1: EXP.C19
!IRQ2: EXP.C20
!IRQ3: EXP.A13
!IRQ4: EXP.A14
!IRQ5: EXP.A15
!IRQ6: EXP.A16
!IRQ7: EXP.A18
!IRQS: EXP.A30
!MEM: EXP.C13 ; also sheet 2
!R: EXP.C15
!RAC: P2.4 ; also sheet 5
!RAGL: P1.3
!RDR: P2.5 ; also sheet 4
!RESET: EXP.C30 ; also sheet 2,3
!RPC: P2.6 ; also sheet 3
!RSTHOLD: EXP.B22
!SKIP: P1.15
!SKIPEXT: EXP.B6
!STI: P1.16
!STPAC: P2.1 ; also sheet 5
!STPDR: P2.2 ; also sheet 4
!SYSDEV: EXP.A28 ; also sheet 2
!T34: EXP.B27
!W: EXP.C16
!WAC: P2.7 ; also sheet 5
!WALU: P1.4
!WAR: P2.8 ; also sheet 2
!WDR: P2.9 ; also sheet 4
!WEN: P1.8
!WIR: P2.19 ; also sheet 2
!WPC: P2.10 ; also sheet 3
!WS: EXP.B8
*TPA: EXP.A17
*TPC: EXP.C17
+3.3V: EXP.A4 EXP.B4 EXP.C4
AB0: EXP.A5 ; also sheet 2
AB1: EXP.A6 ; also sheet 2
AB2: EXP.A7 ; also sheet 2
AB3: EXP.A8 ; also sheet 2
AB4: EXP.A9 ; also sheet 2
AB5: EXP.A10 ; also sheet 2
AB6: EXP.A11 ; also sheet 2
AB7: EXP.A12 ; also sheet 2
AB8: EXP.A20 ; also sheet 2
AB9: EXP.A21 ; also sheet 2
AB10: EXP.A22 ; also sheet 2
AB11: EXP.A23 ; also sheet 2
AB12: EXP.A24 ; also sheet 2
AB13: EXP.A25 ; also sheet 2
AB14: EXP.A26 ; also sheet 2
AB15: EXP.A27 ; also sheet 2
AC0: R6.1 ; also sheet 5
AC1: R7.1 ; also sheet 5
AC2: R8.1 ; also sheet 5
AC3: R9.1 ; also sheet 5
AC4: RN2.8 ; also sheet 5
AC5: RN2.7 ; also sheet 5
AC6: RN2.6 ; also sheet 5
AC7: RN2.5 ; also sheet 5
AC8: RN3.8 ; also sheet 5
AC9: RN3.7 ; also sheet 5
AC10: RN3.6 ; also sheet 5
AC11: RN3.5 ; also sheet 5
AC12: R10.1 ; also sheet 5
AC13: R11.1 ; also sheet 5
AC14: R12.1 ; also sheet 5
AC15: P1.38 ; also sheet 5
AEXT0: EXP.B13
AEXT1: EXP.B14
AEXT2: EXP.B15
AEXT3: EXP.B16
AEXT4: EXP.B17
AEXT5: EXP.B18
AEXT6: EXP.B19
AEXT7: EXP.B20
CLK1: EXP.A29
CLK2: EXP.B29
CLK3: EXP.B30
CLK4: EXP.B28
DB0: EXP.C5
DB1: EXP.C6
DB2: EXP.C7
DB3: EXP.C8
DB4: EXP.C9
DB5: EXP.C10
DB6: EXP.C11
DB7: EXP.C12
DB8: EXP.C21
DB9: EXP.C22
DB10: EXP.C23
DB11: EXP.C24
DB12: EXP.C25
DB13: EXP.C26
DB14: EXP.C27
DB15: EXP.C28
FL: P1.5
FNEG: P2.11 ; also sheet 5
FV: P1.6
FZERO: P2.12 ; also sheet 5
GND [low power]: C46.- C47.- EXP.A1 EXP.A2 EXP.A31 EXP.B1 EXP.B2 EXP.B31 EXP.C1 EXP.C2 EXP.C31 P3.17 P3.18 P3.19 P3.20 P3.21 P3.22 P3.23 P3.24 P4.1 P4.2 P4.3 P4.4 P4.5 P4.6 P4.7 P4.8 P4.9 P4.10 P4.11 P4.12 P4.13 P4.14 P4.15 P4.16 P4.17 P4.18 P4.19 P4.20 P4.37 P4.38 P4.39 P4.40 ; also sheet 2,3,4,5
IBUS0: P2.21 ; also sheet 2,3,4,5
IBUS1: P2.22 ; also sheet 2,3,4,5
IBUS2: P2.23 ; also sheet 2,3,4,5
IBUS3: P2.24 ; also sheet 2,3,4,5
IBUS4: P2.25 ; also sheet 2,3,4,5
IBUS5: P2.26 ; also sheet 2,3,4,5
IBUS6: P2.27 ; also sheet 2,3,4,5
IBUS7: P2.28 ; also sheet 2,3,4,5
IBUS8: P2.29 ; also sheet 2,3,4,5
IBUS9: P2.30 ; also sheet 2,3,4,5
IBUS10: P2.31 ; also sheet 2,3,4,5
IBUS11: P2.32 ; also sheet 2,3,4,5
IBUS12: P2.33 ; also sheet 2,3,4,5
IBUS13: P2.34 ; also sheet 2,3,4,5
IBUS14: P2.35 ; also sheet 2,3,4,5
IBUS15: P2.36 ; also sheet 2,3,4,5
IR0: P1.7
IR2: P1.9
IR11: P1.22
IR12: P2.37
IR13: P2.38
IR14: P2.39
IR15: P2.40
N$53: P1.27 RN2.1
N$54: P1.28 RN2.2
N$55: P1.29 RN2.3
N$56: P1.30 RN2.4
N$57: P1.31 RN3.1
N$58: P1.32 RN3.2
N$59: P1.33 RN3.3
N$60: P1.34 RN3.4
N$61: P1.23 R6.2
N$62: P1.24 R7.2
N$63: P1.25 R8.2
N$64: P1.26 R9.2
N$65: P1.35 R10.2
N$66: P1.36 R11.2
N$67: P1.37 R12.2
OPIF0: P1.18
OPIF1: P1.19
OPIF2: P1.20
OPIF3: P1.21
PC10: R5.1 ; also sheet 3
PC10-C: P2.13 R5.2
PC11: R4.1 ; also sheet 3
PC11-C: P2.14 R4.2
PC12: RN1.8 ; also sheet 3
PC12-C: P2.15 RN1.1
PC13: RN1.7 ; also sheet 3
PC13-C: P2.16 RN1.2
PC14: RN1.6 ; also sheet 3
PC14-C: P2.17 RN1.3
PC15: RN1.5 ; also sheet 3
PC15-C: P2.18 RN1.4
RUNIT0: P1.11
RUNIT1: P1.12
RUNIT2: P1.13
RUNIT3: P1.14
VCC [low power]: C46.+ C47.+ EXP.A3 EXP.A32 EXP.B3 EXP.B32 EXP.C3 EXP.C32 ; also sheet 2,3,4,5
Unconnected: EXP.B5 EXP.B21 EXP.B23

### Buses
IBUS[0..15]

### Notes on the sheet
- CFT Mini-Computer
- Control Bus (processor bus) | Expansion Bus (computer bus)
- Spare Front Panel Connectors
- (Some pins on other sheets)
- (1) | (1) | (1)
- (3)
- (2) | (2)
- (3)
- (3)
- (5)
- PCB @ (0, 1.95) | (4)
- Notes
- (1) This pin is connected to a bus bar for power distribution, but the CFT does not (yet) require it.
- It's likely to be connected to another voltage level like +3.3V for easier interfacing. Reserved for now.
- (2) Pins *TPA and *TPC are not bussed. They are locally connected to each card's corresponding
- test pins (A17 & C17) to serve as test points.
- (3) Reserved for future expansion
- (4) Cheaper, 64-pin A+C row DIN41662 Type C plugs may be used for most expansion cards.
- (5) !IRQ! is provided for systems which lack an interrupt controller (!IRQ0-7!)
- @(0.15, 3.675) | @(5.775, 3.675)
- U
- @(0.15, 0.25) | @(5.775, 0.25)

## Power pins joined to a net without a drawn wire
GND: IC1.3(GND) IC2.10(GND) IC3.10(GND) IC4.8(GND) IC5.10(GND) IC6.10(GND) IC7.7(P:GND) IC8.10(GND) IC9.8(GND) IC10.3(GND) IC11.8(GND) IC12.8(GND) IC13.8(GND) IC14.8(GND) IC15.10(GND) IC16.10(GND) IC17.10(GND) IC18.10(GND) IC19.8(P:GND) IC20.8(GND) IC21.8(GND) IC22.8(GND) IC23.8(GND) IC24.10(GND) IC25.10(GND) IC26.10(GND) IC27.10(GND) IC28.8(GND) IC29.8(GND) IC30.8(GND) IC31.8(GND) IC32.10(GND) IC33.10(GND) IC34.10(GND) IC35.10(GND) IC36.3(GND) IC37.10(GND) IC38.10(GND) IC39.3(GND)
VCC: IC1.5(VCC) IC2.20(VCC) IC3.20(VCC) IC4.16(VCC) IC5.20(VCC) IC6.20(VCC) IC7.14(P:VCC) IC8.20(VCC) IC9.16(VCC) IC10.5(VCC) IC11.16(VCC) IC12.16(VCC) IC13.16(VCC) IC14.16(VCC) IC15.20(VCC) IC16.20(VCC) IC17.20(VCC) IC18.20(VCC) IC19.16(P:VCC) IC20.16(VCC) IC21.16(VCC) IC22.16(VCC) IC23.16(VCC) IC24.20(VCC) IC25.20(VCC) IC26.20(VCC) IC27.20(VCC) IC28.16(VCC) IC29.16(VCC) IC30.16(VCC) IC31.16(VCC) IC32.20(VCC) IC33.20(VCC) IC34.20(VCC) IC35.20(VCC) IC36.5(VCC) IC37.20(VCC) IC38.20(VCC) IC39.5(VCC)

## Library data of the parts
$4_37_$ = alexios:SIGNATURE: Soup signature
$4_39_$ $4_39_$1 = SparkFun:OSHW-LOGO: Open Source Hardware Logo This logo indicates the piece of hardware it is found on incorporates a OSHW license and/or adheres to the definition of open source hardware found here: http://freedomdefined.org/OSHW
$4_40_$ = alexios:QRCODE-*: Various QR codes in silkscreen.
C1-C45 C48 = rcl:C-EU: CAPACITOR, European symbol
C46 C47 = rcl:CPOL-EU: POLARIZED CAPACITOR, European symbol
EXP = alexios-19inch:VG96-3: PCB EUROCARD, 96-pin type C/ABC, 2.54 mm
IC1 IC39 = alexios:74*1G08: 2-input AND gate
IC2 IC3 = alexios:74*574: 8-bit D type FLIP FLOP bus driver
IC4 IC9 = alexios:74*138: 3-line to 8-line DECODER/DEMULTIPLEXER
IC5 IC6 IC15-IC18 IC24-IC27 IC32 IC33 IC37 IC38 = alexios:74*541: Octal BUFFER and LINE DRIVER, 3-state
IC7 = alexios:74*74: Dual D type positive edge triggered FLIP FLOP, preset and clear
IC8 IC34 IC35 = alexios:74*688: 8-bit MAGNITUDE/IDENTITY COMPARATOR, totem pole
IC10 IC36 = alexios:74*1G04: INVERTER Gate
IC11-IC14 IC20-IC23 IC28-IC31 = alexios:74*193: Presettable Synchronous Binary Up/Down Counter Up/down 4-bit binary counter with load and clear inputs, and borrow and carry outputs. Farnell description: <http://uk.farnell.com/nxp/74hct193n/ic-74hct-cmos-74hct193-dip16-5v/dp/382218> Order Code: 382218 Manufacturer Part No: 74HCT193N RoHS : Yes Description: IC, 74HCT CMOS, 74HCT193, DIP16, 5V Counter Type:Binary Clock Frequency:47MHz Count Maximum:15 Supply Voltage Range:4.5V to 5.5V Logic Case Style:DIP No. of Pins:16 Operating Temperature Range:-40°C to +125°C Base Number:74 Clock Frequency Max:43MHz Count Max:16 Counter Measuring Functions:Presettable Synchronous Binary Up / Down Counter Device Marking:74HCT193 IC Generic Number:74HCT193 Logic Function Number:193 Logic IC Base Number:74193 Logic IC Family:HCT Logic IC Function:Presettable Synchronous 4bit Binary Up/Down Counter No. of Gates:1 No. of Inputs:4 Operating Temperature Max:125°C Operating Temperature Min:-40°C Package / Case:DIP Supply Voltage:5V Supply Voltage Max:5.5V Supply Voltage Min:4.5V Termination Type:Through Hole
IC19 = alexios:74*139: Dual 2-line to 4-line DECODER/DEMULTIPLEXER
P1-P4 = con-3m:2540-: 3M (TM) Pak 100 4-Wall Header Source: 3M; OC_FARNELL: 9838414; OC_NEWARK: unknown
R1-R12 R14 = resistor:R-EU_: RESISTOR, European symbol
RN1-RN3 = resistor-net:CTS742C083: Chip Resistor Array 4 Single Resistor Source: http://www.ctscorp.com/components/Datasheets/CTSChipArrayDs.pdf; OC_FARNELL: unknown; OC_NEWARK: unknown
U1-U4 = alexios:HOLE: Hole for a standoff or mount. Hole diameter: 3.3mm. External Diameter: 6mm. Suitable for M3 standoffs.
X1 = alexios:SIGNAL-RENAME: Connect two signals of different names.

## Net classes
0 default: width 0.254 mm, clearance 0.152 mm
1 low power: width 0.305 mm, clearance 0.152 mm
2 LED power: width 0.406 mm, clearance 0.254 mm